# EAGLE schematic board (EAGLE 9.2.2)
CNAME: MAKER_Sensor_Node; CREVISION: V1.0; DESIGNER: Kihun Song
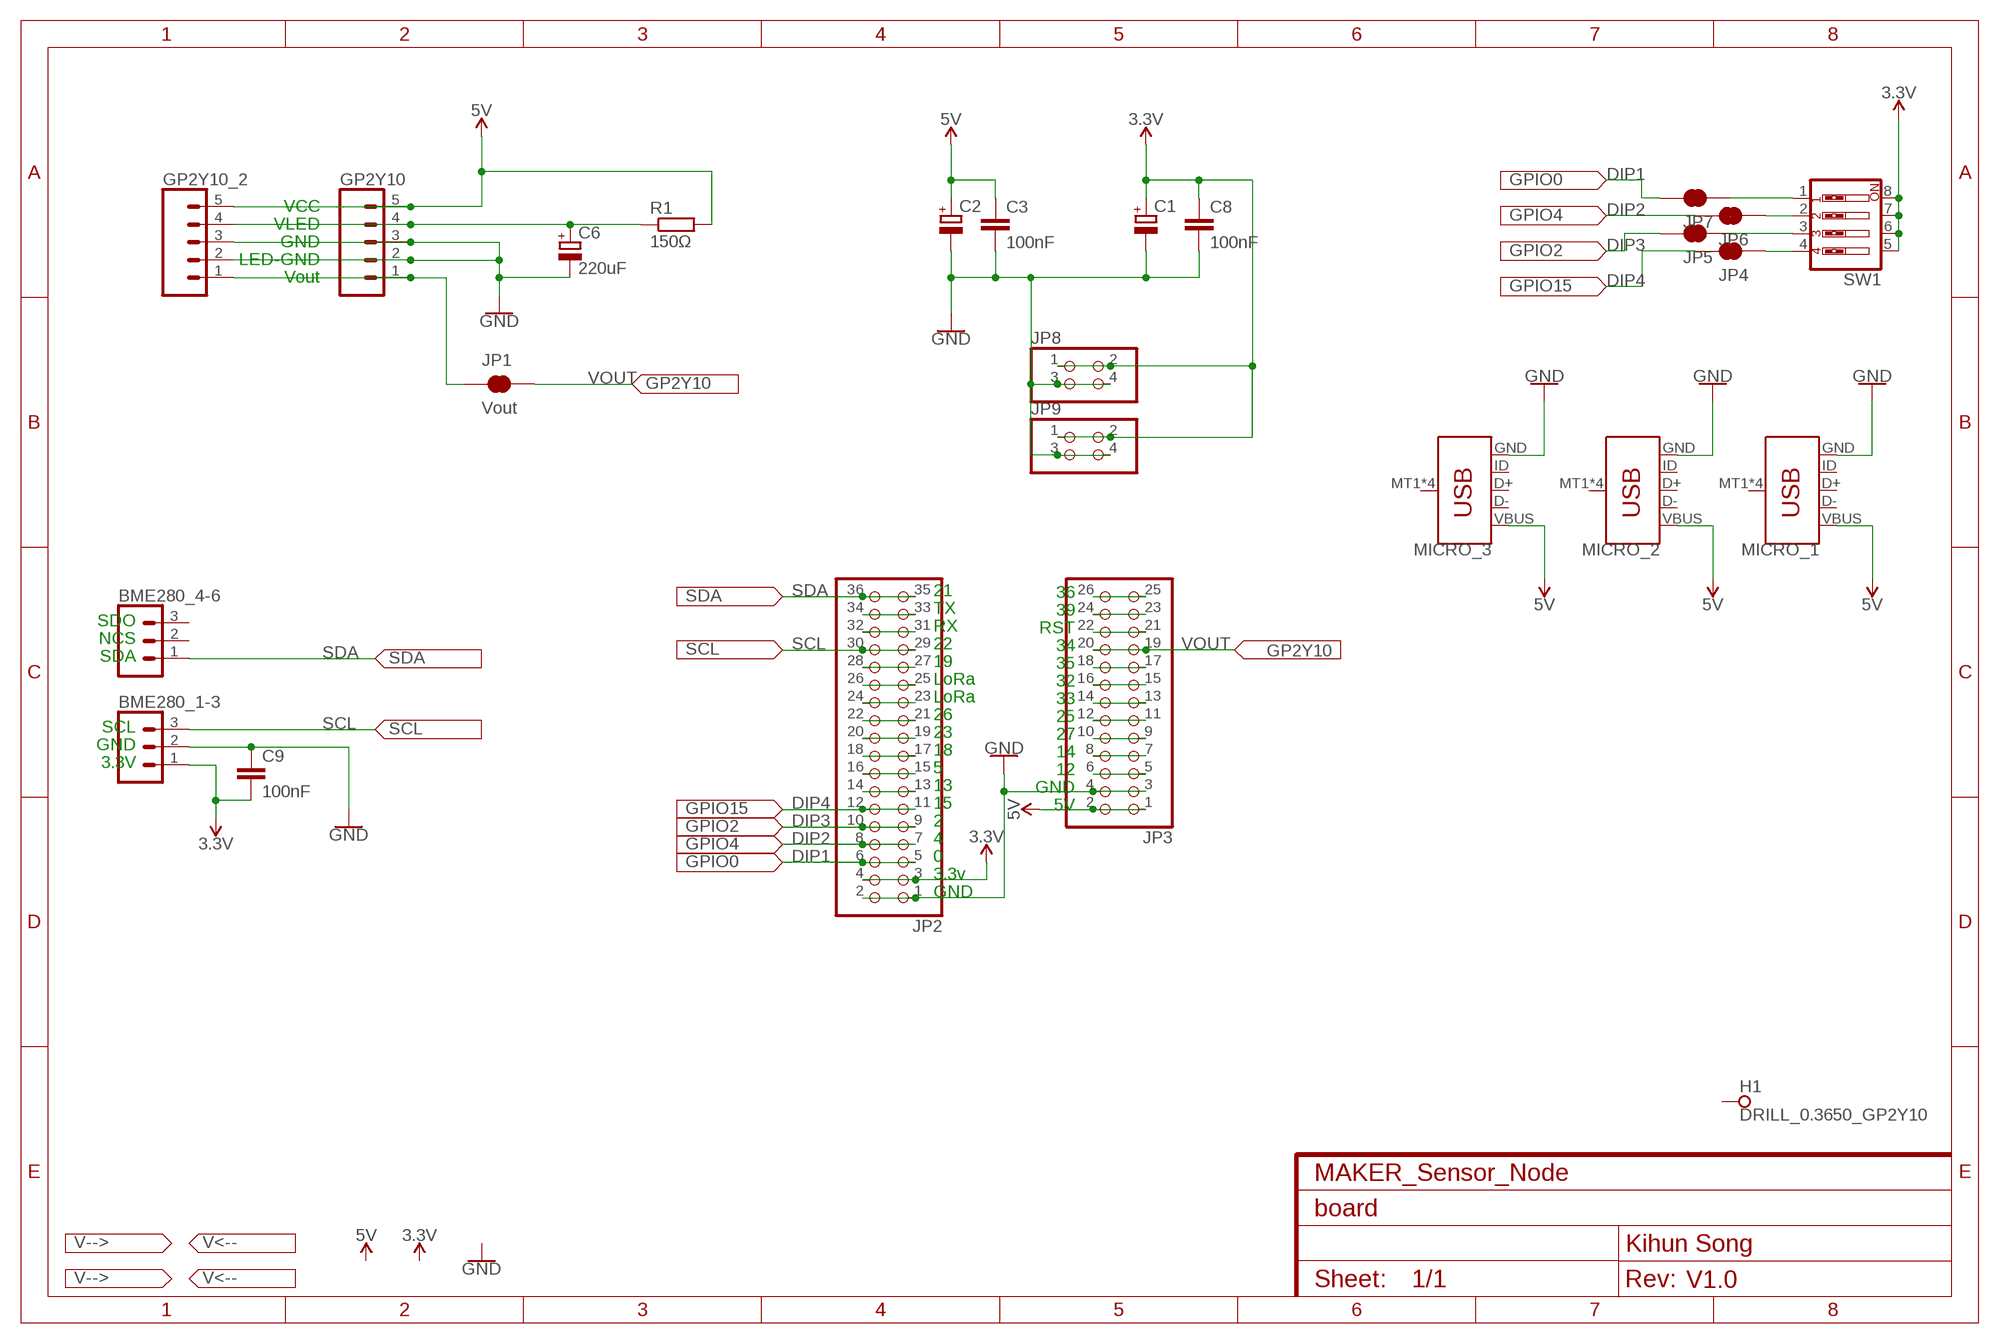
[diagram p0: schematic, sheet 1]

## Parts
BME280_1-3  CONN_03  [1X03]
BME280_4-6  CONN_03  [1X03]
C1  CPOL-EUD  [PANASONIC_D]
C2  CPOL-EUD  [PANASONIC_D]
C3  100nF  C-EUC0805  [C0805]
C6  220uF  CPOL-EUE2.5-5  [E2,5-5]
C8  100nF  C-EUC0805  [C0805]
C9  100nF  C-EUC0805  [C0805]
GP2Y10  CONN_05  [1X05]
GP2Y10_2  CONN_05PTH_LONGPADS  [1X05_LONGPADS]
H1  DRILL_0.3650_GP2Y10  SPECIAL_DRILL_0.3650  [PAD_0.3650]
JP1  Vout  JUMPER-SMT_2_NC_TRACE_SILK  [SMT-JUMPER_2_NC_TRACE_SILK]
JP2  PINHD-2X18  [2X18]
JP3  PINHD-2X13  [2X13]
JP4  JUMPER-SMT_2_NC_TRACE_SILK  [SMT-JUMPER_2_NC_TRACE_SILK]
JP5  JUMPER-SMT_2_NC_TRACE_SILK  [SMT-JUMPER_2_NC_TRACE_SILK]
JP6  JUMPER-SMT_2_NC_TRACE_SILK  [SMT-JUMPER_2_NC_TRACE_SILK]
JP7  JUMPER-SMT_2_NC_TRACE_SILK  [SMT-JUMPER_2_NC_TRACE_SILK]
JP8  PINHD-2X2/OCT  [2X02]
JP9  PINHD-2X2/OCT  [2X02]
MICRO_1  USB_MICRO-B_SMT  [USB-MICROB]
MICRO_2  USB_MICRO-B_SMT  [USB-MICROB]
MICRO_3  USB_MICRO-B_SMT  [USB-MICROB]
R1  150Ω  R-EU_0204/7  [0204/7]
SW1  SW_DIP-4  [EDG-04]

## Nets
3.3V [power]: BME280_1-3.1 C1.+ C8.1 C9.2 JP2.3 JP2.4 JP8.1 JP8.2 JP9.1 JP9.2 SW1.5 SW1.6 SW1.7 SW1.8
5V [power]: C2.+ C3.1 GP2Y10.5 GP2Y10_2.5 JP3.1 JP3.2 MICRO_1.VBUS MICRO_2.VBUS MICRO_3.VBUS R1.2
DIP1: JP2.5 JP2.6 JP7.2
DIP2: JP2.7 JP2.8 JP6.2
DIP3: JP2.9 JP2.10 JP5.2
DIP4: JP2.11 JP2.12 JP4.2
GND [power]: BME280_1-3.2 C1.- C2.- C3.2 C6.- C8.2 C9.1 GP2Y10.2 GP2Y10.3 GP2Y10_2.2 GP2Y10_2.3 JP2.1 JP2.2 JP3.3 JP3.4 JP8.3 JP8.4 JP9.3 JP9.4 MICRO_1.GND MICRO_2.GND MICRO_3.GND
N$1: JP7.1 SW1.1
N$2: JP6.1 SW1.2
N$4: JP2.33 JP2.34
N$5: JP2.31 JP2.32
N$7: JP2.27 JP2.28
N$8: JP2.25 JP2.26
N$9: JP3.25 JP3.26
N$10: JP3.23 JP3.24
N$11: JP3.21 JP3.22
N$12: JP3.17 JP3.18
N$13: JP5.1 SW1.3
N$14: JP3.15 JP3.16
N$15: JP3.13 JP3.14
N$16: JP3.11 JP3.12
N$17: JP3.9 JP3.10
N$18: JP3.7 JP3.8
N$19: JP3.5 JP3.6
N$21: JP4.1 SW1.4
N$28: JP2.13 JP2.14
N$29: JP2.15 JP2.16
N$30: JP2.17 JP2.18
N$31: JP2.19 JP2.20
N$32: JP2.21 JP2.22
N$33: JP2.23 JP2.24
SCL: BME280_1-3.3 JP2.29 JP2.30
SDA: BME280_4-6.1 JP2.35 JP2.36
VLED [power]: C6.+ GP2Y10.4 GP2Y10_2.4 R1.1
VOUT: JP1.2 JP3.19 JP3.20
VOUT_1: GP2Y10.1 GP2Y10_2.1 JP1.1
Unconnected: BME280_4-6.2 BME280_4-6.3 H1.1 MICRO_1.D+ MICRO_1.D- MICRO_1.ID MICRO_1.MT1(SHIELD) MICRO_1.MT2(SHIELD) MICRO_1.P$1(SHIELD) MICRO_1.P$2(SHIELD) MICRO_2.D+ MICRO_2.D- MICRO_2.ID MICRO_2.MT1(SHIELD) MICRO_2.MT2(SHIELD) MICRO_2.P$1(SHIELD) MICRO_2.P$2(SHIELD) MICRO_3.D+ MICRO_3.D- MICRO_3.ID MICRO_3.MT1(SHIELD) MICRO_3.MT2(SHIELD) MICRO_3.P$1(SHIELD) MICRO_3.P$2(SHIELD)

## Notes on the sheet
- VCC
- VLED
- GND
- LED-GND
- Vout
- 36
- 21
- 39
- SDO | TX
- RST
- NCS | RX
- 34
- SDA | 22
- 35
- 19
- 32
- LoRa
- 33
- LoRa
- 25
- SCL | 26
- 27
- GND | 23
- 14
- 3.3V | 18
- 12
- 5
- GND
- 13
- 5V
- 15
- 2
- 4
- 0
- 3.3v
- GND

## Library data of the parts
BME280_1-3 BME280_4-6 = SparkFun-Connectors:CONN_03: Multi connection point. Often used as Generic Header-pin footprint for 0.1 inch spaced/style header connections On any of the 0.1 inch spaced packages, you can populate with these: Break Away Headers - Straight <https://www.sparkfun.com/products/116> (PRT-00116) Break Away Male Headers - Right Angle <https://www.sparkfun.com/products/553> (PRT-00553) Female Headers <https://www.sparkfun.com/products/115> (PRT-00115) Break Away Headers - Machine Pin <https://www.sparkfun.com/products/117> (PRT-00117) Break Away Female Headers - Swiss Machine Pin <https://www.sparkfun.com/products/743> (PRT-00743) Stackable Header - 3 Pin (Female, 0.1") <https://www.sparkfun.com/products/13875> (PRT-13875) For SCREWTERMINALS and SPRING TERMINALS visit here: Screw Terimnals on SparkFun.com <https://www.sparkfun.com/search/results?term=Screw+Terminals> (5mm/3.5mm/2.54mm spacing) This device is also useful as a general connection point to wire up your design to another part of your project. Our various solder wires solder well into these plated through hole pads. Hook-Up Wire - Assortment (Stranded, 22 AWG) <https://www.sparkfun.com/products/11375> (PRT-11375) Hook-Up Wire - Assortment (Solid Core, 22 AWG) <https://www.sparkfun.com/products/11367> (PRT-11367) View the entire wire category on our website here <https://www.sparkfun.com/categories/141> Special notes: Molex polarized connector foot print use with SKU : PRT-08232 with associated crimp pins and housings.
C1 C2 C6 = rcl:CPOL-EU: POLARIZED CAPACITOR, European symbol; SPICEPREFIX: C
C3 C8 C9 = rcl:C-EU: CAPACITOR, European symbol; SPICEPREFIX: C
GP2Y10 GP2Y10_2 = SparkFun-Connectors:CONN_05: Multi connection point. Often used as Generic Header-pin footprint for 0.1 inch spaced/style header connections On any of the 0.1 inch spaced packages, you can populate with these: Break Away Headers - Straight <https://www.sparkfun.com/products/116> (PRT-00116) Break Away Male Headers - Right Angle <https://www.sparkfun.com/products/553> (PRT-00553) Female Headers <https://www.sparkfun.com/products/115> (PRT-00115) Break Away Headers - Machine Pin <https://www.sparkfun.com/products/117> (PRT-00117) Break Away Female Headers - Swiss Machine Pin <https://www.sparkfun.com/products/743> (PRT-00743) For SCREWTERMINALS and SPRING TERMINALS visit here: Screw Terimnals on SparkFun.com <https://www.sparkfun.com/search/results?term=Screw+Terminals> (5mm/3.5mm/2.54mm spacing) This device is also useful as a general connection point to wire up your design to another part of your project. Our various solder wires solder well into these plated through hole pads. Hook-Up Wire - Assortment (Stranded, 22 AWG) <https://www.sparkfun.com/products/11375> (PRT-11375) Hook-Up Wire - Assortment (Solid Core, 22 AWG) <https://www.sparkfun.com/products/11367> (PRT-11367) View the entire wire category on our website here <https://www.sparkfun.com/categories/141> Special notes: Molex polarized connector foot print use with SKU : PRT-08231 with associated crimp pins and housings. 1MM SMD Version SKU: PRT-10208
H1 = special-drill:SPECIAL_DRILL_: Special drills
JP1 JP4-JP7 = SparkFun-Jumpers:JUMPER-SMT_2_NC_TRACE: Normally closed trace jumper This jumper has a trace between two pads so it's normally closed (NC). Use a razor knife to open the connection. For best results follow the IPC guidelines for cutting traces: Cutout at least 0.063 mm (0.005 in). Remove all loose material to clean up the cut area. Seal the cut with an approved epoxy. Reapply solder to reclose the connection.
JP2 = pinhead:PINHD-2X18: PIN HEADER
JP3 = pinhead:PINHD-2X13: PIN HEADER
JP8 JP9 = pinhead_v2:PINHD-2X2: PIN HEADER
MICRO_1-MICRO_3 = SparkFun-Connectors:USB_MICRO-B: USB Type Micro-B Connector Male/female and PTH/SMT variants SparkFun Products: SparkFun microB USB Breakout <https://www.sparkfun.com/products/12035> SparkFun USB microB Plug Breakout <https://www.sparkfun.com/products/10031> SparkFun ESP8266 Thing <https://www.sparkfun.com/products/13231>; PROD_ID: CONN-09505; SF_ID: PRT-08533
R1 = rcl:R-EU_: RESISTOR, European symbol; SPICEPREFIX: R
SW1 = special:SW_DIP-4: DIP SWITCH

## Net classes
0 default: width 0.254 mm, clearance 0.205 mm
1 power: width 0.914 mm, clearance 0.254 mm